# Altium project smart_garden.PrjPcb
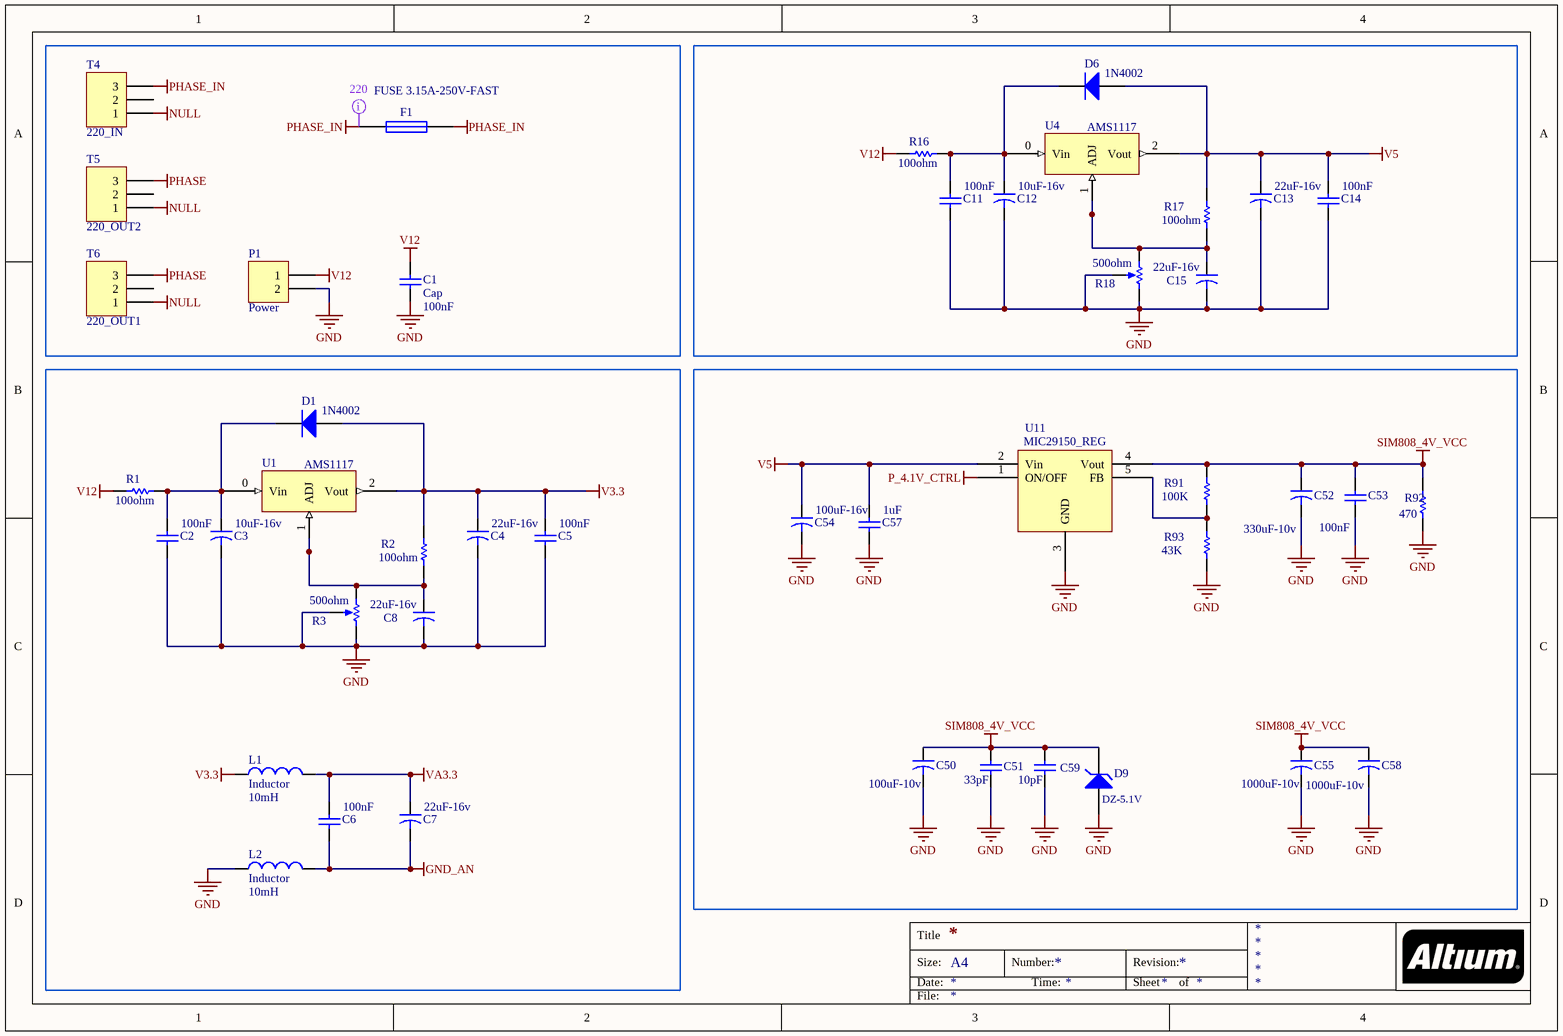
[diagram p0: smartGarden_Pow_Rev01.SchDoc]
8 sheets, 270 parts. Net scope: global (net labels, ports and power ports of the same name join across sheets).
Sheets:
  smartGarden_Pow_Rev01.SchDoc
  smartGarden_Sen_Rev01.SchDoc
  smartGarden_Mcu_Rev01.SchDoc
  smartGarden_ACT_Rev01.SchDoc
  smartGarden_COM_Rev01.SchDoc
  smartGarden_Per_Rev01.SchDoc
  smartGarden_Driver_Rev01.SchDoc
  smartGarden_COM2_Rev01.SchDoc

## Sheet smartGarden_Pow_Rev01.SchDoc
size A4

### Parts
C1  Cap  value 100nF  [0805_smd]
C2  value 100nF  [0805_smd]  (hidden comment: Cap)
C3  value 10uF-16v  [CAPR5-4X5]  (hidden comment: Cap2)
C4  value 22uF-16v  [C100uF/25V]  (hidden comment: Cap2)
C5  value 100nF  [0805_smd]  (hidden comment: Cap)
C6  value 100nF  [0805_smd]  (hidden comment: Cap)
C7  value 22uF-16v  [C100uF/25V]  (hidden comment: Cap2)
C8  value 22uF-16v  [C100uF/25V]  (hidden comment: Cap2)
C11  value 100nF  [0805_smd]  (hidden comment: Cap)
C12  value 10uF-16v  [CAPR5-4X5]  (hidden comment: Cap2)
C13  value 22uF-16v  [C100uF/25V]  (hidden comment: Cap2)
C14  value 100nF  [0805_smd]  (hidden comment: Cap)
C15  value 22uF-16v  [C100uF/25V]  (hidden comment: Cap2)
C50  value 100uF-10v  [CAPR5-4X5]  (hidden comment: Cap2)
C51  33pF  [0805_smd]
C52  value 330uF-10v  [CAPR5-4X5]  (hidden comment: Cap2)
C53  value 100nF  [0805_smd]  (hidden comment: Cap)
C54  value 100uF-16v  [C100uF/25V]  (hidden comment: Cap2)
C55  value 1000uF-10v  [CAPR5-4X5]  (hidden comment: Cap2)
C57  value 1uF  [0805_smd]  (hidden comment: Cap)
C58  value 1000uF-10v  [CAPR5-4X5]  (hidden comment: Cap2)
C59  10pF  [0805_smd]
D1  1N4002  [7227_SMD]
D6  1N4002  [7227_SMD]
D9  DZ-5.1V  [MLL34_SMD]
F1  FUSE 3.15A-250V-FAST  [FUSE1]
L1  Inductor  value 10mH  [0402-A]
L2  Inductor  value 10mH  [0402-A]
P1  Power  [PCON_L2]
R1  value 100ohm  [1206_SMD]  (hidden comment: Res1)
R2  value 100ohm  [0805_smd]  (hidden comment: Res1)
R3  value 500ohm  [Trimmer Pot]  (hidden comment: RPot)
R16  value 100ohm  [1206_SMD]  (hidden comment: Res1)
R17  value 100ohm  [0805_smd]  (hidden comment: Res1)
R18  value 500ohm  [Trimmer Pot]  (hidden comment: RPot)
R91  value 100K  [0805_smd]  (hidden comment: Res1)
R92  value 470  [1206_SMD]  (hidden comment: Res1)
R93  value 43K  [0805_smd]  (hidden comment: Res1)
T4  220_IN  [PCON_L3]
T5  220_OUT2  [PCON_L3]
T6  220_OUT1  [PCON_L3]
U1  AMS1117  [SOT223]
U4  AMS1117  [SOT223]
U11  MIC29150_REG

### Nets
GND: C1.1 C2.1 C3.2 C4.2 C5.1 C8.2 C11.1 C12.2 C13.2 C14.1 C15.2 C50.2 C51.1 C52.2 C53.1 C54.2 C55.2 C57.1 C58.2 C59.1 D9.A L2.1 P1.2 R3.2(BOT) R3.3(TAP) R18.2(BOT) R18.3(TAP) R92.1 R93.1 U11.3(GND)
GND_AN: C6.1 C7.2 L2.2
NULL: T4.1 T5.1 T6.1
P_4.1V_CTRL: U11.1(ON/OFF)
PHASE: T5.3 T6.3
PHASE_IN: F1.1 F1.2 T4.3
SIM808_4V_VCC: C50.1 C51.2 C52.1 C53.2 C55.1 C58.1 C59.2 D9.K R91.2 R92.2 U11.4(Vout)
V3.3: C4.1 C5.2 D1.1(A) L1.1 R2.2 U1.2(Vout)
V5: C13.1 C14.2 C54.1 C57.2 D6.1(A) R17.2 U4.2(Vout) U11.2(Vin)
V12: C1.2 P1.1 R1.2 R16.2
VA3.3: C6.2 C7.1 L1.2
NetC2_2: C2.2 C3.1 D1.2(K) R1.1 U1.0(Vin)
NetC8_1: C8.1 R2.1 R3.1(TOP) U1.1(ADJ)
NetC11_2: C11.2 C12.1 D6.2(K) R16.1 U4.0(Vin)
NetC15_1: C15.1 R17.1 R18.1(TOP) U4.1(ADJ)
NetR91_1: R91.1 R93.2 U11.5(FB)

Not connected (* = marked no-connect by the designer): T4 2; T5 2; T6 2

### Layout directives
net class 220: PHASE_IN

### Notes on the sheet
- Title
- Size:
- Date:
- A4
- Number:
- Time:
- Revision:
- Sheet
- of
- File:

### Library data of the parts
C1 C2 C5 C6 C11 C14 C53 C57 = Cap: Capacitor; Published: 8-Jun-2000; LatestRevisionDate: 17-Jul-2002; LatestRevisionNote: Re-released for DXP Platform.; PackageReference: RAD-0.3; Publisher: Altium Limited; PackageDescription: Radial Cap, Thru-Hole; 2 Leads; 0.3 in Pin Spacing
C3 C4 C7 C8 C12 C13 C15 C50 C52 C54 C55 C58 = Cap2: Capacitor; Published: 23-Sep-2002; PackageReference: CAPR5-4X5; Publisher: Altium Limited; PackageDescription: Capacitor; 2 Leads
C51 C59 = Cap: Capacitor; Value: 100u; Published: 8-Jun-2000; LatestRevisionDate: 17-Jul-2002; LatestRevisionNote: Re-released for DXP Platform.; PackageReference: RAD-0.3; Publisher: Altium Limited
D1 D6 = Diode 1N4002: 1 Amp General Purpose Rectifier; Published: 8-Jun-2000; LatestRevisionDate: 17-Jul-2002; LatestRevisionNote: Re-released for DXP Platform.; DatasheetVersion: 1998; PackageVersion: Aug-1999; PackageReference: DO-41; Publisher: Altium Limited; PackageDescription: Diode, Axial; Body 5.2 x 2.7 mm (LxDia. max), Lead Dia. 0.86 mm (max); Code_JEDEC: DO-204-AL; ComponentLink1Description: Manufacturer Link; ComponentLink1URL: http://www.fairchildsemi.com/; ComponentLink2Description: Datasheet; ComponentLink2URL: http://www.fairchildsemi.com/ds/1N%2F1N4001.pdf
D9 = D Zener: Zener Diode; Published: 8-Jun-2000; LatestRevisionDate: 17-Jul-2002; LatestRevisionNote: Re-released for DXP Platform.; PackageReference: DIODE-0.7; Publisher: Altium Limited
F1 = FUSE1: Fuse
L1 L2 = Inductor: Code_IEC: 1005; Published: 8-Jun-2000; LatestRevisionDate: 29-May-2009; LatestRevisionNote: IPC-7351 Footprint Added.; PackageReference: 0402-A; Publisher: Altium Limited; PackageDescription: Chip Inductor; Code_JEITA: 0402
P1 = Header 2: Header, 2-Pin; LatestRevisionDate: 17-Jul-2002; LatestRevisionNote: Re-released for DXP Platform.; Publisher: Altium Limited
R1 R2 R16 R17 R91-R93 = Res1: Resistor; Published: 8-Jun-2000; LatestRevisionDate: 17-Jul-2002; LatestRevisionNote: Re-released for DXP Platform.; PackageReference: AXIAL-0.3; Publisher: Altium Limited; PackageDescription: Axial Device, Thru-Hole; 2 Leads; 0.3 in Pin Spacing
R3 R18 = RPot: Potentiometer; Sim Note: Enter the Resistance value and the set point into parameter fields.; Set Position: 0.5; Published: 8-Jun-2000; LatestRevisionDate: 17-Jul-2002; LatestRevisionNote: Re-released for DXP Platform.; PackageReference: VR5; Publisher: Altium Limited; PackageDescription: Variable Resistor, Thru-Hole; 3 Leads
T4-T6 = Header 3: Header, 3-Pin; LatestRevisionDate: 17-Jul-2002; LatestRevisionNote: Re-released for DXP Platform.; Publisher: Altium Limited
U1 U4 = AMS1117: pin to pad: 0>3

## Sheet smartGarden_Sen_Rev01.SchDoc
size A
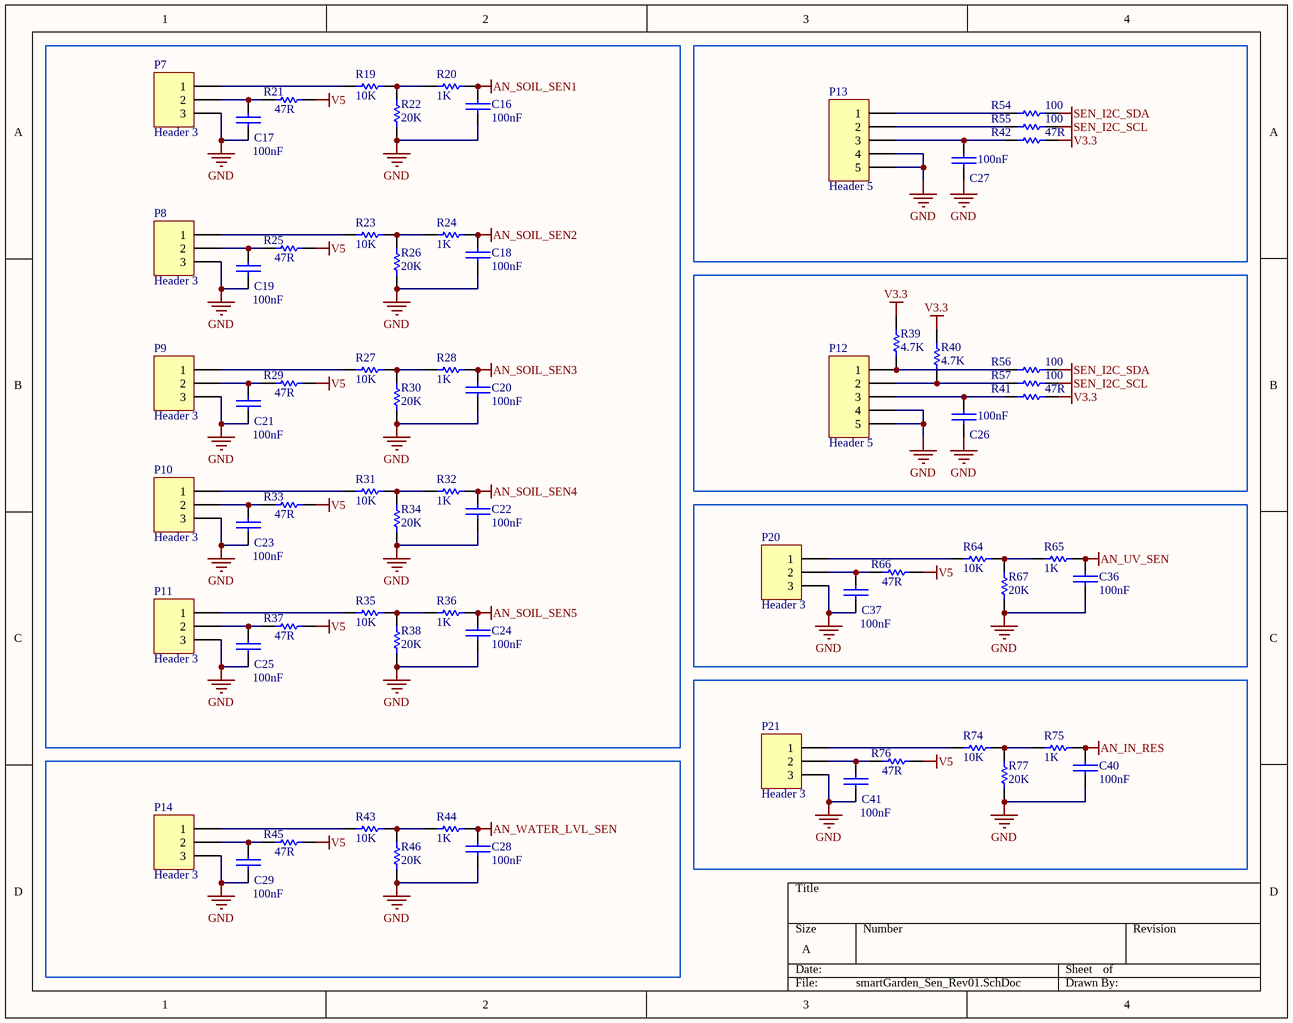
[diagram p1: smartGarden_Sen_Rev01.SchDoc]

### Parts
C16  100nF  [0805_smd]
C17  100nF  [0805_smd]
C18  100nF  [0805_smd]
C19  100nF  [0805_smd]
C20  100nF  [0805_smd]
C21  100nF  [0805_smd]
C22  100nF  [0805_smd]
C23  100nF  [0805_smd]
C24  100nF  [0805_smd]
C25  100nF  [0805_smd]
C26  100nF  [0805_smd]
C27  100nF  [0805_smd]
C28  100nF  [0805_smd]
C29  100nF  [0805_smd]
C36  100nF  [0805_smd]
C37  100nF  [0805_smd]
C40  100nF  [0805_smd]
C41  100nF  [0805_smd]
P7  Header 3  [HDR1X3]
P8  Header 3  [HDR1X3]
P9  Header 3  [HDR1X3]
P10  Header 3  [HDR1X3]
P11  Header 3  [HDR1X3]
P12  Header 5  [HDR1X5]
P13  Header 5  [HDR1X5]
P14  Header 3  [HDR1X3]
P20  Header 3  [HDR1X3]
P21  Header 3  [HDR1X3]
R19  10K  [0805_smd]
R20  1K  [0805_smd]
R21  47R  [0805_smd]
R22  20K  [0805_smd]
R23  10K  [0805_smd]
R24  1K  [0805_smd]
R25  47R  [0805_smd]
R26  20K  [0805_smd]
R27  10K  [0805_smd]
R28  1K  [0805_smd]
R29  47R  [0805_smd]
R30  20K  [0805_smd]
R31  10K  [0805_smd]
R32  1K  [0805_smd]
R33  47R  [0805_smd]
R34  20K  [0805_smd]
R35  10K  [0805_smd]
R36  1K  [0805_smd]
R37  47R  [0805_smd]
R38  20K  [0805_smd]
R39  4.7K  [0805_smd]
R40  4.7K  [0805_smd]
R41  47R  [0805_smd]
R42  47R  [0805_smd]
R43  10K  [0805_smd]
R44  1K  [0805_smd]
R45  47R  [0805_smd]
R46  20K  [0805_smd]
R54  100  [0805_smd]
R55  100  [0805_smd]
R56  100  [0805_smd]
R57  100  [0805_smd]
R64  10K  [0805_smd]
R65  1K  [0805_smd]
R66  47R  [0805_smd]
R67  20K  [0805_smd]
R74  10K  [0805_smd]
R75  1K  [0805_smd]
R76  47R  [0805_smd]
R77  20K  [0805_smd]

### Nets
AN_IN_RES: C40.2 R75.1
AN_SOIL_SEN1: C16.2 R20.1
AN_SOIL_SEN2: C18.2 R24.1
AN_SOIL_SEN3: C20.2 R28.1
AN_SOIL_SEN4: C22.2 R32.1
AN_SOIL_SEN5: C24.2 R36.1
AN_UV_SEN: C36.2 R65.1
AN_WATER_LVL_SEN: C28.2 R44.1
GND: C16.1 C17.1 C18.1 C19.1 C20.1 C21.1 C22.1 C23.1 C24.1 C25.1 C26.1 C27.1 C28.1 C29.1 C36.1 C37.1 C40.1 C41.1 P7.3 P8.3 P9.3 P10.3 P11.3 P12.4 P12.5 P13.4 P13.5 P14.3 P20.3 P21.3 R22.2 R26.2 R30.2 R34.2 R38.2 R46.2 R67.2 R77.2
SEN_I2C_SCL: R55.1 R57.1
SEN_I2C_SDA: R54.1 R56.1
V3.3: R39.1 R40.1 R41.1 R42.1
V5: R21.1 R25.1 R29.1 R33.1 R37.1 R45.1 R66.1 R76.1
NetC17_2: C17.2 P7.2 R21.2
NetC19_2: C19.2 P8.2 R25.2
NetC21_2: C21.2 P9.2 R29.2
NetC23_2: C23.2 P10.2 R33.2
NetC25_2: C25.2 P11.2 R37.2
NetC26_2: C26.2 P12.3 R41.2
NetC27_2: C27.2 P13.3 R42.2
NetC29_2: C29.2 P14.2 R45.2
NetC37_2: C37.2 P20.2 R66.2
NetC41_2: C41.2 P21.2 R76.2
NetP7_1: P7.1 R19.2
NetP8_1: P8.1 R23.2
NetP9_1: P9.1 R27.2
NetP10_1: P10.1 R31.2
NetP11_1: P11.1 R35.2
NetP12_1: P12.1 R39.2 R56.2
NetP12_2: P12.2 R40.2 R57.2
NetP13_1: P13.1 R54.2
NetP13_2: P13.2 R55.2
NetP14_1: P14.1 R43.2
NetP20_1: P20.1 R64.2
NetP21_1: P21.1 R74.2
NetR19_1: R19.1 R20.2 R22.1
NetR23_1: R23.1 R24.2 R26.1
NetR27_1: R27.1 R28.2 R30.1
NetR31_1: R31.1 R32.2 R34.1
NetR35_1: R35.1 R36.2 R38.1
NetR43_1: R43.1 R44.2 R46.1
NetR64_1: R64.1 R65.2 R67.1
NetR74_1: R74.1 R75.2 R77.1

### Library data of the parts
C16-C29 C36 C37 C40 C41 = CAP: Capacitor
P7-P11 P14 P20 P21 = Header 3: Header, 3-Pin; LatestRevisionDate: 17-Jul-2002; LatestRevisionNote: Re-released for DXP Platform.; Publisher: Altium Limited
P12 P13 = Header 5: Header, 5-Pin; LatestRevisionDate: 17-Jul-2002; LatestRevisionNote: Re-released for DXP Platform.; Publisher: Altium Limited
R19-R46 R54-R57 R64-R67 R74-R77 = Res1: Resistor; Published: 8-Jun-2000; LatestRevisionDate: 17-Jul-2002; LatestRevisionNote: Re-released for DXP Platform.; PackageReference: AXIAL-0.3; Publisher: Altium Limited

## Sheet smartGarden_Mcu_Rev01.SchDoc
size A
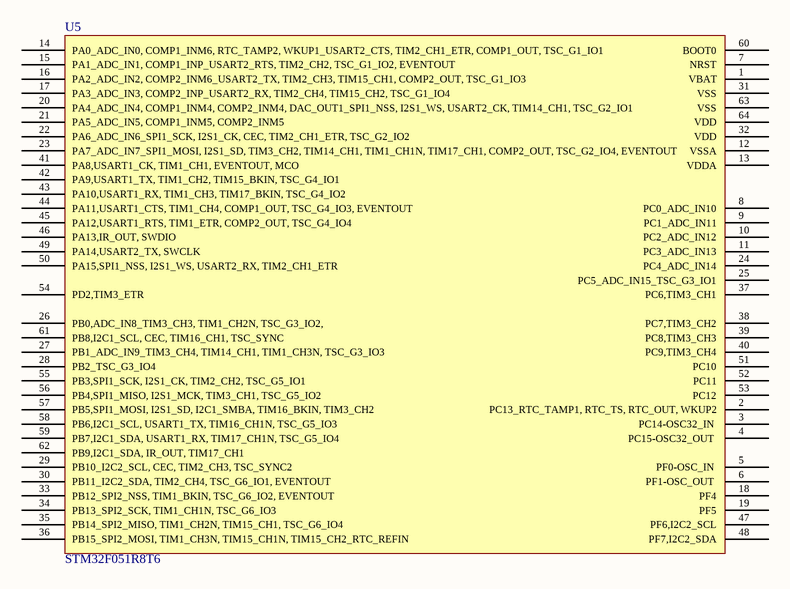
[diagram p2: smartGarden_Mcu_Rev01.SchDoc]

### Parts
U5  STM32F051R8T6  [LQFP64]

### Nets

Not connected (* = marked no-connect by the designer): U5 1(VBAT) 2(PC13_RTC_TAMP1,_RTC_TS,_RTC_OUT,_WKUP2) 3(PC14-OSC32_IN_) 4(PC15-OSC32_OUT_) 5(PF0-OSC_IN_) 6(PF1-OSC_OUT_) 7(NRST) 8(PC0_ADC_IN10) 9(PC1_ADC_IN11) 10(PC2_ADC_IN12) 11(PC3_ADC_IN13) 12(VSSA) 13(VDDA) 14(PA0_ADC_IN0,_COMP1_INM6,_RTC_TAMP2,_WKUP1_USART2_CTS,_TIM2_CH1_ETR,_COMP1_OUT,_TSC_G1_IO1) 15(PA1_ADC_IN1,_COMP1_INP_USART2_RTS,_TIM2_CH2,_TSC_G1_IO2,_EVENTOUT) 16(PA2_ADC_IN2,_COMP2_INM6_USART2_TX,_TIM2_CH3,_TIM15_CH1,_COMP2_OUT,_TSC_G1_IO3) 17(PA3_ADC_IN3,_COMP2_INP_USART2_RX,_TIM2_CH4,_TIM15_CH2,_TSC_G1_IO4) 18(PF4) 19(PF5) 20(PA4_ADC_IN4,_COMP1_INM4,_COMP2_INM4,_DAC_OUT1_SPI1_NSS,_I2S1_WS,_USART2_CK,_TIM14_CH1,_TSC_G2_IO1) 21(PA5_ADC_IN5,_COMP1_INM5,_COMP2_INM5) 22(PA6_ADC_IN6_SPI1_SCK,_I2S1_CK,_CEC,_TIM2_CH1_ETR,_TSC_G2_IO2) 23(PA7_ADC_IN7_SPI1_MOSI,_I2S1_SD,_TIM3_CH2,_TIM14_CH1,_TIM1_CH1N,_TIM17_CH1,_COMP2_OUT,_TSC_G2_IO4,_EVENTOUT) 24(PC4_ADC_IN14) 25(PC5_ADC_IN15_TSC_G3_IO1) 26(PB0,ADC_IN8_TIM3_CH3,_TIM1_CH2N,_TSC_G3_IO2,_) 27(PB1_ADC_IN9_TIM3_CH4,_TIM14_CH1,_TIM1_CH3N,_TSC_G3_IO3) 28(PB2_TSC_G3_IO4) 29(PB10_I2C2_SCL,_CEC,_TIM2_CH3,_TSC_SYNC2) 30(PB11_I2C2_SDA,_TIM2_CH4,_TSC_G6_IO1,_EVENTOUT) 31(VSS) 32(VDD) 33(PB12_SPI2_NSS,_TIM1_BKIN,_TSC_G6_IO2,_EVENTOUT) 34(PB13_SPI2_SCK,_TIM1_CH1N,_TSC_G6_IO3) 35(PB14_SPI2_MISO,_TIM1_CH2N,_TIM15_CH1,_TSC_G6_IO4) 36(PB15_SPI2_MOSI,_TIM1_CH3N,_TIM15_CH1N,_TIM15_CH2_RTC_REFIN) 37(PC6,TIM3_CH1) 38(PC7,TIM3_CH2) 39(PC8,TIM3_CH3) 40(PC9,TIM3_CH4) 41(PA8,USART1_CK,_TIM1_CH1,_EVENTOUT,_MCO) 42(PA9,USART1_TX,_TIM1_CH2,_TIM15_BKIN,_TSC_G4_IO1) 43(PA10,USART1_RX,_TIM1_CH3,_TIM17_BKIN,_TSC_G4_IO2) 44(PA11,USART1_CTS,_TIM1_CH4,_COMP1_OUT,_TSC_G4_IO3,_EVENTOUT) 45(PA12,USART1_RTS,_TIM1_ETR,_COMP2_OUT,_TSC_G4_IO4) 46(PA13,IR_OUT,_SWDIO) 47(PF6,I2C2_SCL) 48(PF7,I2C2_SDA) 49(PA14,USART2_TX,_SWCLK) 50(PA15,SPI1_NSS,_I2S1_WS,_USART2_RX,_TIM2_CH1_ETR) 51(PC10) 52(PC11) 53(PC12) 54(PD2,TIM3_ETR) 55(PB3,SPI1_SCK,_I2S1_CK,_TIM2_CH2,_TSC_G5_IO1) 56(PB4,SPI1_MISO,_I2S1_MCK,_TIM3_CH1,_TSC_G5_IO2) 57(PB5,SPI1_MOSI,_I2S1_SD,_I2C1_SMBA,_TIM16_BKIN,_TIM3_CH2) 58(PB6,I2C1_SCL,_USART1_TX,_TIM16_CH1N,_TSC_G5_IO3) 59(PB7,I2C1_SDA,_USART1_RX,_TIM17_CH1N,_TSC_G5_IO4) 60(BOOT0) 61(PB8,I2C1_SCL,_CEC,_TIM16_CH1,_TSC_SYNC) 62(PB9,I2C1_SDA,_IR_OUT,_TIM17_CH1) 63(VSS) 64(VDD)

## Sheet smartGarden_ACT_Rev01.SchDoc
size A
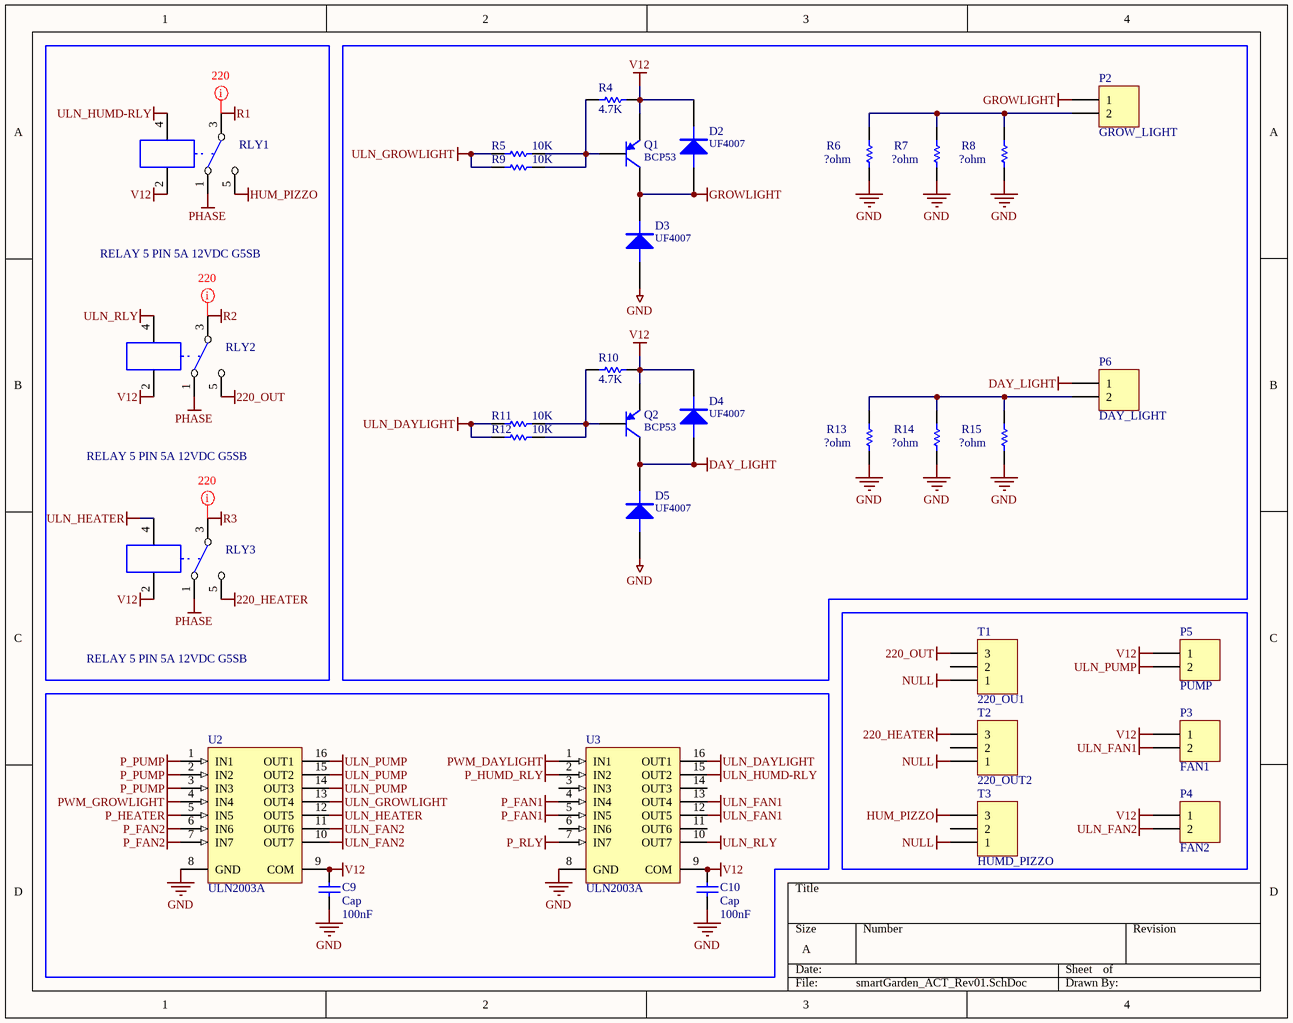
[diagram p3: smartGarden_ACT_Rev01.SchDoc]

### Parts
C9  Cap  value 100nF  [0805_smd]
C10  Cap  value 100nF  [0805_smd]
D2  UF4007  [7227_SMD]
D3  UF4007  [7227_SMD]
D4  UF4007  [7227_SMD]
D5  UF4007  [7227_SMD]
P2  GROW_LIGHT  [PCON_L2]
P3  FAN1  [CON2_XH]
P4  FAN2  [CON2_XH]
P5  PUMP  [CON2_XH]
P6  DAY_LIGHT  [PCON_L2]
Q1  BCP53  [SOT223]
Q2  BCP53  [SOT223]
R4  4.7K  [0805_smd]
R5  10K  [1206_SMD]
R6  value ?ohm  [0805_smd]  (hidden comment: Res1)
R7  value ?ohm  [0805_smd]  (hidden comment: Res1)
R8  value ?ohm  [0805_smd]  (hidden comment: Res1)
R9  10K  [1206_SMD]
R10  4.7K  [0805_smd]
R11  10K  [1206_SMD]
R12  10K  [1206_SMD]
R13  value ?ohm  [0805_smd]  (hidden comment: Res1)
R14  value ?ohm  [0805_smd]  (hidden comment: Res1)
R15  value ?ohm  [0805_smd]  (hidden comment: Res1)
RLY1  RELAY 5 PIN 5A 12VDC G5SB  [RLY_G5S]
RLY2  RELAY 5 PIN 5A 12VDC G5SB  [RLY_G5S]
RLY3  RELAY 5 PIN 5A 12VDC G5SB  [RLY_G5S]
T1  220_OU1  [PCON_L3]
T2  220_OUT2  [PCON_L3]
T3  HUMD_PIZZO  [PCON_L3]
U2  ULN2003A  [SO-16_smd]
U3  ULN2003A  [SO-16_smd]

### Nets
220_HEATER: RLY3.5(NO) T2.3
220_OUT: RLY2.5(NO) T1.3
DAY_LIGHT: D4.A D5.K P6.1 Q2.2(C)
GND: C9.1 C10.1 D3.A D5.A R6.1 R7.1 R8.1 R13.1 R14.1 R15.1 U2.8(GND) U3.8(GND)
GROWLIGHT: D2.A D3.K P2.1 Q1.2(C)
HUM_PIZZO: RLY1.5(NO) T3.3
NULL: T1.1 T2.1 T3.1
P_FAN1: U3.4(IN4) U3.5(IN5)
P_FAN2: U2.6(IN6) U2.7(IN7)
P_HEATER: U2.5(IN5)
P_HUMD_RLY: U3.2(IN2)
P_PUMP: U2.1(IN1) U2.2(IN2) U2.3(IN3)
P_RLY: U3.7(IN7)
PHASE: RLY1.1(NC) RLY2.1(NC) RLY3.1(NC)
PWM_DAYLIGHT: U3.1(IN1)
PWM_GROWLIGHT: U2.4(IN4)
R1: RLY1.3(COM)
R2: RLY2.3(COM)
R3: RLY3.3(COM)
ULN_DAYLIGHT: R11.2 R12.2 U3.16(OUT1)
ULN_FAN1: P3.2 U3.12(OUT5) U3.13(OUT4)
ULN_FAN2: P4.2 U2.10(OUT7) U2.11(OUT6)
ULN_GROWLIGHT: R5.2 R9.2 U2.13(OUT4)
ULN_HEATER: RLY3.4(B) U2.12(OUT5)
ULN_HUMD-RLY: RLY1.4(B) U3.15(OUT2)
ULN_PUMP: P5.2 U2.14(OUT3) U2.15(OUT2) U2.16(OUT1)
ULN_RLY: RLY2.4(B) U3.10(OUT7)
V12: C9.2 C10.2 D2.K D4.K P3.1 P4.1 P5.1 Q1.3(E) Q2.3(E) R4.1 R10.1 RLY1.2(A) RLY2.2(A) RLY3.2(A) U2.9(COM) U3.9(COM)
NetP2_2: P2.2 R6.2 R7.2 R8.2
NetP6_2: P6.2 R13.2 R14.2 R15.2
NetQ1_1: Q1.1(B) R4.2 R5.1 R9.1
NetQ2_1: Q2.1(B) R10.2 R11.1 R12.1

Not connected (* = marked no-connect by the designer): T1 2; T2 2; T3 2; U3 3(IN3) 6(IN6) 11(OUT6) 14(OUT3)

### Layout directives
net class 220: R1, R2, R3

### Library data of the parts
C9 C10 = Cap: Capacitor; Published: 8-Jun-2000; LatestRevisionDate: 17-Jul-2002; LatestRevisionNote: Re-released for DXP Platform.; PackageReference: RAD-0.3; Publisher: Altium Limited; PackageDescription: Radial Cap, Thru-Hole; 2 Leads; 0.3 in Pin Spacing
D2-D5 = DIODE
P2-P6 = Header 2: Header, 2-Pin; LatestRevisionDate: 17-Jul-2002; LatestRevisionNote: Re-released for DXP Platform.; Publisher: Altium Limited
Q1 Q2 = 2N3906
R4 R5 R9-R12 = Res: Resistor; LatestRevisionNote: Re-released for DXP Platform.; PackageDescription: Axial Device, Thru-Hole; 2 Leads; 0.3 in Pin Spacing; PackageReference: AXIAL-0.3; Published: 8-Jun-2000; Publisher: Altium Limited; LatestRevisionDate: 17-Jul-2002
R6-R8 R13-R15 = Res1: Resistor; Published: 8-Jun-2000; LatestRevisionDate: 17-Jul-2002; LatestRevisionNote: Re-released for DXP Platform.; PackageReference: AXIAL-0.3; Publisher: Altium Limited; PackageDescription: Axial Device, Thru-Hole; 2 Leads; 0.3 in Pin Spacing
RLY1-RLY3 = RELAY-SPDT
T1-T3 = Header 3: Header, 3-Pin; LatestRevisionDate: 17-Jul-2002; LatestRevisionNote: Re-released for DXP Platform.; Publisher: Altium Limited
U2 U3 = ULN2004A: High-Voltage, High-Current Darlington Array; Published: 13-Oct-2000; LatestRevisionDate: 06-Jun-2005; LatestRevisionNote: Stylized 3D Model Added.; DatasheetVersion: 1998; PackageVersion: 1998; PackageReference: A16; Publisher: Altium Limited; PackageDescription: DIP; 16 Leads; Row Spacing 7.62 mm; Pitch 2.54 mm; Code_JEDEC: MS-001-BB; ComponentLink1Description: Manufacturer Link; ComponentLink1URL: http://www.allegromicro.com/

## Sheet smartGarden_COM_Rev01.SchDoc
size A
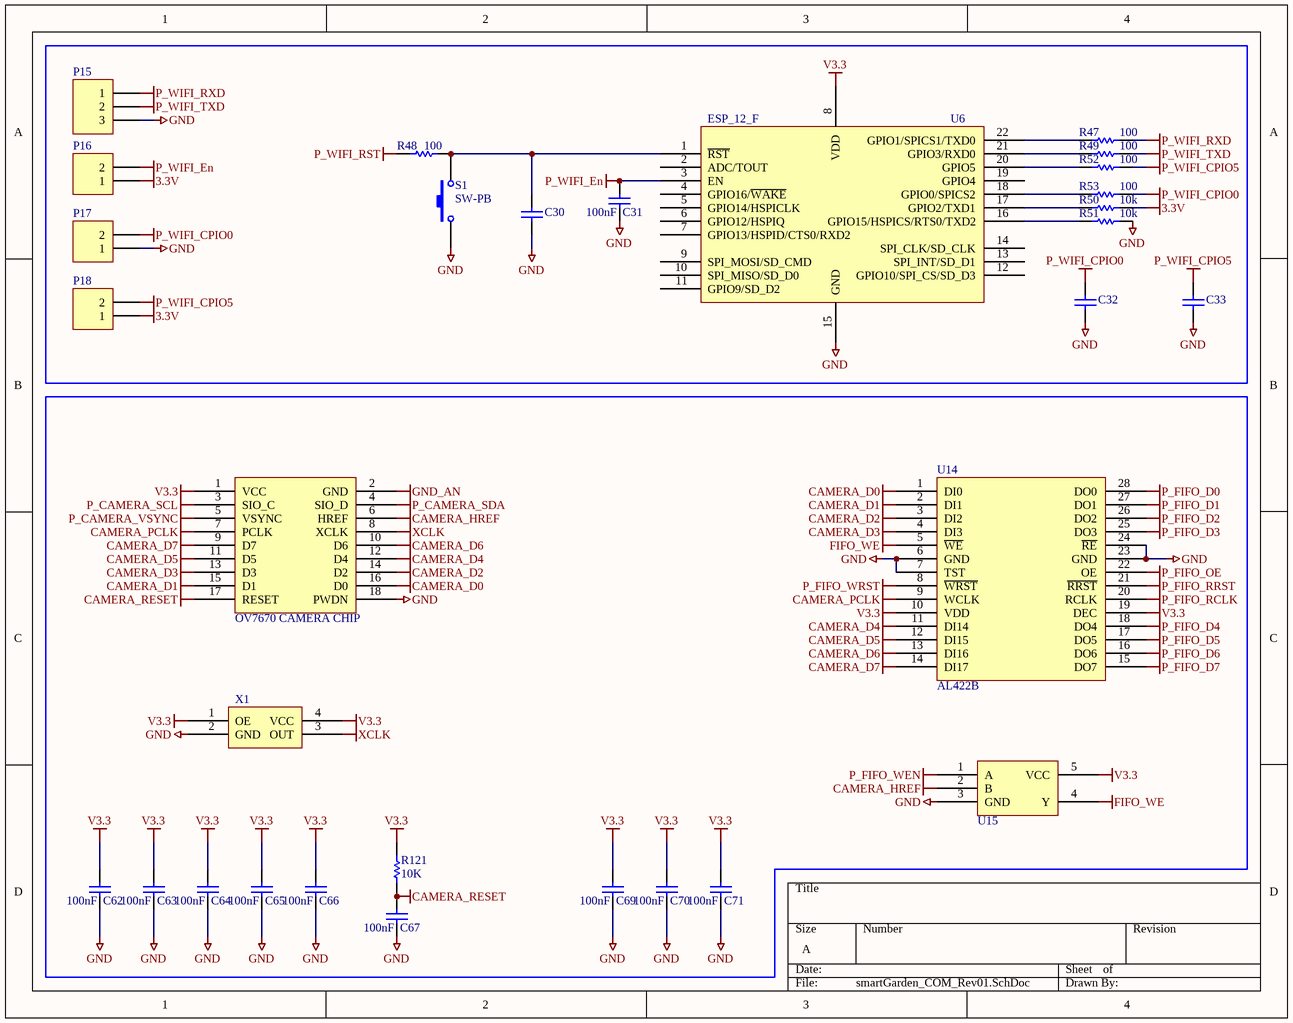
[diagram p4: smartGarden_COM_Rev01.SchDoc]

### Parts
C30  100nF_SKIP  [0805_smd]  (value not drawn)
C31  100nF  [0805_SMD]
C32  100n_skip  [0805_SMD]  (value not drawn)
C33  100n_skip  [0805_SMD]  (value not drawn)
C62  100nF  [0805_SMD]
C63  100nF  [0805_SMD]
C64  100nF  [0805_SMD]
C65  100nF  [0805_SMD]
C66  100nF  [0805_SMD]
C67  100nF  [0805_SMD]
C69  100nF  [0805_SMD]
C70  100nF  [0805_SMD]
C71  100nF  [0805_SMD]
P15  CON 1*40 PIN HEADER 5H MALE 2.54  [CON3_XH]  (value not drawn)
P16  Header 2  [HDR1X2]  (value not drawn)
P17  Header 2  [HDR1X2]  (value not drawn)
P18  Header 2  [HDR1X2]  (value not drawn)
R47  100  [0805_smd]
R48  100  [0805_smd]
R49  100  [0805_smd]
R50  10k  [0805_smd]
R51  10k  [0805_smd]
R52  100  [0805_smd]
R53  100  [0805_smd]
R121  10K  [0805_smd]
S1  SW-PB  [SW_4.5*4.5]
U6  ESP_12_F  [ESP_12_E]
U13  OV7670 CAMERA CHIP
U14  AL422B
U15  NAND  (value not drawn)
X1  4PIN OSCILLATOR  (value not drawn)

### Nets
3.3V: P16.1 P18.1 R50.1
CAMERA_D0: U13.16(D0) U14.1(DI0)
CAMERA_D1: U13.15(D1) U14.2(DI1)
CAMERA_D2: U13.14(D2) U14.3(DI2)
CAMERA_D3: U13.13(D3) U14.4(DI3)
CAMERA_D4: U13.12(D4) U14.11(DI14)
CAMERA_D5: U13.11(D5) U14.12(DI15)
CAMERA_D6: U13.10(D6) U14.13(DI16)
CAMERA_D7: U13.9(D7) U14.14(DI17)
CAMERA_HREF: U13.6(HREF) U15.2(B)
CAMERA_PCLK: U13.7(PCLK) U14.9(WCLK)
CAMERA_RESET: C67.2 R121.2 U13.17(RESET)
FIFO_WE: U14.5(~{WE}) U15.4(Y)
GND: C30.1 C31.1 C32.1 C33.1 C62.1 C63.1 C64.1 C65.1 C66.1 C67.1 C69.1 C70.1 C71.1 P15.3 P17.1 R51.1 S1.1 U6.15(GND) U13.18(PWDN) U14.6(GND) U14.7(TST) U14.23(GND) U14.24(~{RE}) U15.3(GND) X1.2(GND)
GND_AN: U13.2(GND)
P_CAMERA_SCL: U13.3(SIO_C)
P_CAMERA_SDA: U13.4(SIO_D)
P_CAMERA_VSYNC: U13.5(VSYNC)
P_FIFO_D0: U14.28(DO0)
P_FIFO_D1: U14.27(DO1)
P_FIFO_D2: U14.26(DO2)
P_FIFO_D3: U14.25(DO3)
P_FIFO_D4: U14.18(DO4)
P_FIFO_D5: U14.17(DO5)
P_FIFO_D6: U14.16(DO6)
P_FIFO_D7: U14.15(DO7)
P_FIFO_OE: U14.22(OE)
P_FIFO_RCLK: U14.20(RCLK)
P_FIFO_RRST: U14.21(~{RRST})
P_FIFO_WEN: U15.1(A)
P_FIFO_WRST: U14.8(~{WRST})
P_WIFI_CPIO0: C32.2 P17.2 R53.1
P_WIFI_CPIO5: C33.2 P18.2 R52.1
P_WIFI_En: C31.2 P16.2 U6.3(EN)
P_WIFI_RST: R48.2
P_WIFI_RXD: P15.1 R47.1
P_WIFI_TXD: P15.2 R49.1
V3.3: C62.2 C63.2 C64.2 C65.2 C66.2 C69.2 C70.2 C71.2 R121.1 U6.8(VDD) U13.1(VCC) U14.10(VDD) U14.19(DEC) U15.5(VCC) X1.1(OE) X1.4(VCC)
XCLK: U13.8(XCLK) X1.3(OUT)
NetC30_2: C30.2 R48.1 S1.2 U6.1(~{RST})
NetR47_2: R47.2 U6.22(GPIO1/SPICS1/TXD0)
NetR49_2: R49.2 U6.21(GPIO3/RXD0)
NetR50_2: R50.2 U6.17(GPIO2/TXD1)
NetR51_2: R51.2 U6.16(GPIO15/HSPICS/RTS0/TXD2)
NetR52_2: R52.2 U6.20(GPIO5)
NetR53_2: R53.2 U6.18(GPIO0/SPICS2)

Not connected (* = marked no-connect by the designer): U6 2(ADC/TOUT) 4(GPIO16/~{WAKE}) 5(GPIO14/HSPICLK) 6(GPIO12/HSPIQ) 7(GPIO13/HSPID/CTS0/RXD2) 9(SPI_MOSI/SD_CMD) 10(SPI_MISO/SD_D0) 11(GPIO9/SD_D2) 12(GPIO10/SPI_CS/SD_D3) 13(SPI_INT/SD_D1) 14(SPI_CLK/SD_CLK) 19(GPIO4)

### Library data of the parts
C30 C32 C33 = Cap Semi: Capacitor (Semiconductor SIM Model); Value: 100nF; Published: 8-Jun-2000; LatestRevisionDate: 17-Jul-2002; LatestRevisionNote: Re-released for DXP Platform.; PackageReference: C1206; Publisher: Altium Limited
C31 C62-C67 C69-C71 = Cap Semi: Capacitor (Semiconductor SIM Model); Published: 8-Jun-2000; LatestRevisionDate: 17-Jul-2002; LatestRevisionNote: Re-released for DXP Platform.; PackageReference: C1206; Publisher: Altium Limited; Value: 100nF
P15 = Header 3: Header, 3-Pin; LatestRevisionDate: 17-Jul-2002; LatestRevisionNote: Re-released for DXP Platform.; Publisher: Altium Limited
P16-P18 = Header 2: Header, 2-Pin; LatestRevisionDate: 17-Jul-2002; LatestRevisionNote: Re-released for DXP Platform.; Publisher: Altium Limited
R47-R53 R121 = Res Semi: Semiconductor Resistor; Value: 1k; Published: 8-Jun-2000; LatestRevisionDate: 17-Jul-2002; LatestRevisionNote: Re-released for DXP Platform.; PackageReference: AXIAL-0.5; Publisher: Altium Limited
S1 = SW-PB: Switch; Published: 24-Mar-1999; LatestRevisionDate: 17-Jul-2002; LatestRevisionNote: Re-released for DXP Platform.; PackageReference: SPST-2; Publisher: Altium Limited
U6 = ESP_12_E: ESP-12 Wi-Fi Module by AI-Thinker; IC: ESP8266-EX; Vendor: Ai-thinker
U15 = SN74LVC1G00

## Sheet smartGarden_Per_Rev01.SchDoc
size A
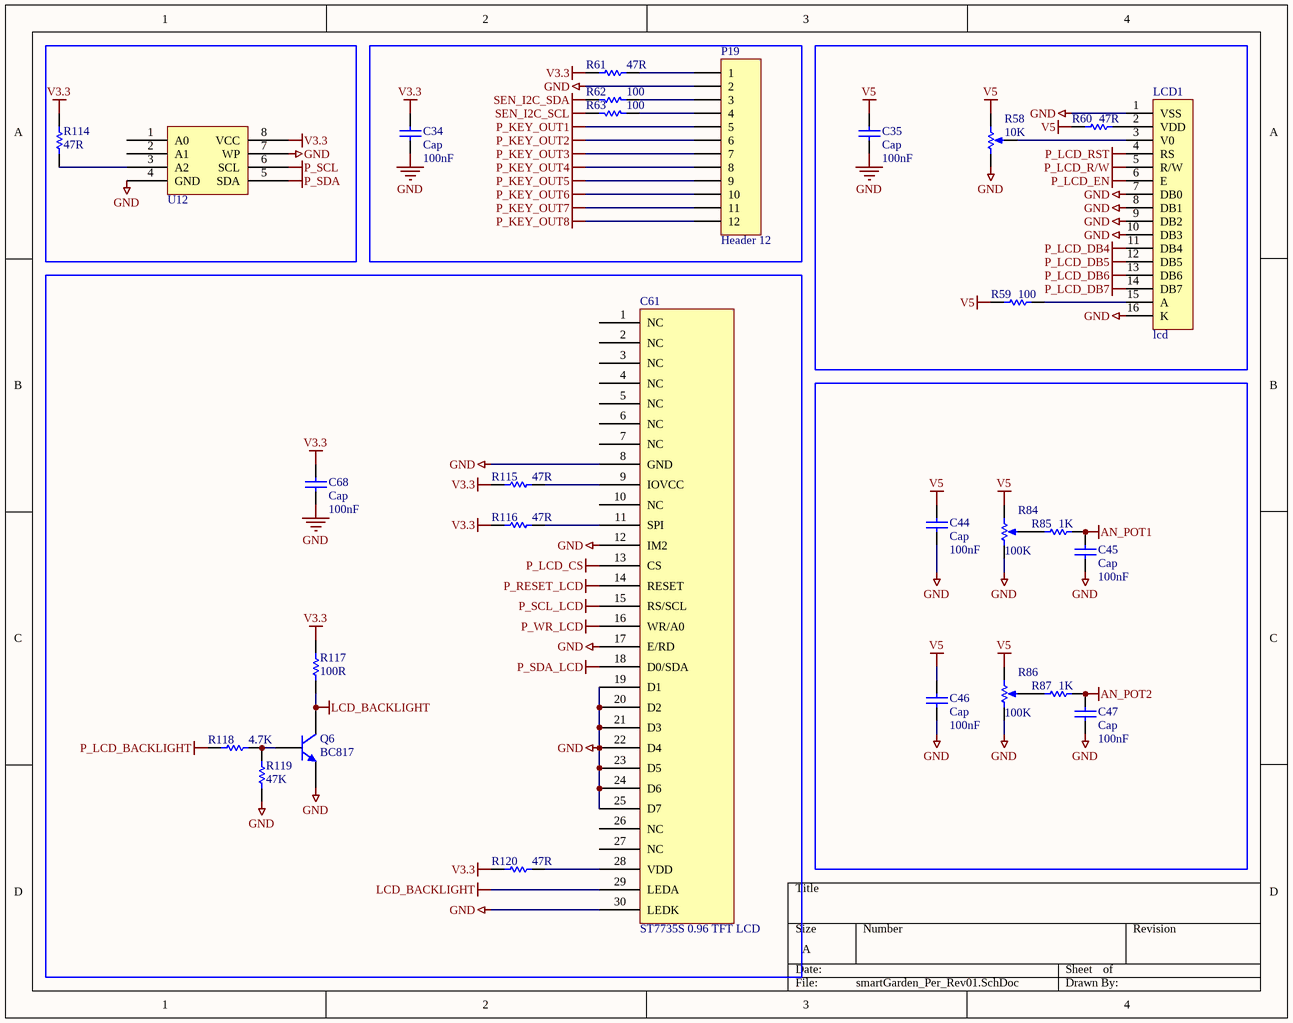
[diagram p5: smartGarden_Per_Rev01.SchDoc]

### Parts
C34  Cap  value 100nF  [0805_smd]
C35  Cap  value 100nF  [0805_smd]
C44  Cap  value 100nF  [0805_smd]
C45  Cap  value 100nF  [0805_smd]
C46  Cap  value 100nF  [0805_smd]
C47  Cap  value 100nF  [0805_smd]
C61  ST7735S 0.96 TFT LCD
C68  Cap  value 100nF  [0805_smd]
LCD1  lcd  [LCD2*16]
P19  Header 12  [CON12_XH]
Q6  BC817  [TO-226-AA]
R58  value 10K  [Trimmer Pot]  (hidden comment: RPot)
R59  100  [0805_smd]
R60  47R  [0805_smd]
R61  47R  [0805_smd]
R62  100  [0805_smd]
R63  100  [0805_smd]
R84  value 100K  [POT_V15]  (hidden comment: RPot)
R85  1K  [0805_smd]
R86  value 100K  [POT_V15]  (hidden comment: RPot)
R87  1K  [0805_smd]
R114  47R  [0805_smd]
R115  47R  [0805_smd]
R116  47R  [0805_smd]
R117  100R  [0805_smd]
R118  4.7K  [0805_smd]
R119  47K  [0805_smd]
R120  47R  [0805_smd]
U12  AT24C08  [SOIC8]  (value not drawn)

### Nets
AN_POT1: C45.2 R85.1
AN_POT2: C47.2 R87.1
GND: C34.1 C35.1 C44.1 C45.1 C46.1 C47.1 C61.8(GND) C61.12(IM2) C61.17(E/RD) C61.19(D1) C61.20(D2) C61.21(D3) C61.22(D4) C61.23(D5) C61.24(D6) C61.25(D7) C61.30(LEDK) C68.1 LCD1.1(VSS) LCD1.7(DB0) LCD1.8(DB1) LCD1.9(DB2) LCD1.10(DB3) LCD1.16(K) P19.2 Q6.3(E) R58.1(TOP) R84.1(TOP) R86.1(TOP) R119.2 U12.4(GND) U12.7(WP)
LCD_BACKLIGHT: C61.29(LEDA) Q6.1(C) R117.1
P_KEY_OUT1: P19.5
P_KEY_OUT2: P19.6
P_KEY_OUT3: P19.7
P_KEY_OUT4: P19.8
P_KEY_OUT5: P19.9
P_KEY_OUT6: P19.10
P_KEY_OUT7: P19.11
P_KEY_OUT8: P19.12
P_LCD_BACKLIGHT: R118.2
P_LCD_CS: C61.13(CS)
P_LCD_DB4: LCD1.11(DB4)
P_LCD_DB5: LCD1.12(DB5)
P_LCD_DB6: LCD1.13(DB6)
P_LCD_DB7: LCD1.14(DB7)
P_LCD_EN: LCD1.6(E)
P_LCD_R/W: LCD1.5(R/W)
P_LCD_RST: LCD1.4(RS)
P_RESET_LCD: C61.14(RESET)
P_SCL: U12.6(SCL)
P_SCL_LCD: C61.15(RS/SCL)
P_SDA: U12.5(SDA)
P_SDA_LCD: C61.18(D0/SDA)
P_WR_LCD: C61.16(WR/A0)
SEN_I2C_SCL: R63.1
SEN_I2C_SDA: R62.1
V3.3: C34.2 C68.2 R61.2 R114.1 R115.2 R116.2 R117.2 R120.2 U12.8(VCC)
V5: C35.2 C44.2 C46.2 R58.2(BOT) R59.2 R60.2 R84.2(BOT) R86.2(BOT)
NetC61_9: C61.9(IOVCC) R115.1
NetC61_11: C61.11(SPI) R116.1
NetC61_28: C61.28(VDD) R120.1
NetLCD1_2: LCD1.2(VDD) R60.1
NetLCD1_3: LCD1.3(V0) R58.3(TAP)
NetLCD1_15: LCD1.15(A) R59.1
NetP19_1: P19.1 R61.1
NetP19_3: P19.3 R62.2
NetP19_4: P19.4 R63.2
NetQ6_2: Q6.2(B) R118.1 R119.1
NetR84_3: R84.3(TAP) R85.2
NetR86_3: R86.3(TAP) R87.2
NetR114_2: R114.2 U12.3(A2)

Not connected (* = marked no-connect by the designer): C61 1(NC) 2(NC) 3(NC) 4(NC) 5(NC) 6(NC) 7(NC) 10(NC) 26(NC) 27(NC); U12 1(A0) 2(A1)

### Library data of the parts
C34 C35 C44-C47 C68 = Cap: Capacitor; Published: 8-Jun-2000; LatestRevisionDate: 17-Jul-2002; LatestRevisionNote: Re-released for DXP Platform.; PackageReference: RAD-0.3; Publisher: Altium Limited; PackageDescription: Radial Cap, Thru-Hole; 2 Leads; 0.3 in Pin Spacing
LCD1 = LCD16
P19 = Header 12: Header, 12-Pin; LatestRevisionDate: 17-Jul-2002; LatestRevisionNote: Re-released for DXP Platform.; Publisher: Altium Limited
Q6 = NPN: NPN Bipolar Transistor; Published: 8-Jun-2000; LatestRevisionDate: 17-Jul-2002; LatestRevisionNote: Re-released for DXP Platform.; PackageReference: TO-226-AA; Publisher: Altium Limited; PackageDescription: TO, Flat Index; 3 In-Line, Axial Leads; Body Dia. 4.8mm; Leads 0.55 x 0.51 mm (max); Code_JEDEC: TO-226-AA
R58 R84 R86 = RPot: as R3 on sheet smartGarden_Pow_Rev01; Published: 8-Jun-2000; LatestRevisionDate: 17-Jul-2002; LatestRevisionNote: Re-released for DXP Platform.; PackageReference: VR5; Publisher: Altium Limited; PackageDescription: Variable Resistor, Thru-Hole; 3 Leads
R59-R61 R114-R120 = Res Semi: Semiconductor Resistor; Value: 1k; Published: 8-Jun-2000; LatestRevisionDate: 17-Jul-2002; LatestRevisionNote: Re-released for DXP Platform.; PackageReference: AXIAL-0.5; Publisher: Altium Limited
R62 R63 = Res1: Resistor; Published: 8-Jun-2000; LatestRevisionDate: 17-Jul-2002; LatestRevisionNote: Re-released for DXP Platform.; PackageReference: AXIAL-0.3; Publisher: Altium Limited
R85 R87 = Res Semi: Semiconductor Resistor; Published: 8-Jun-2000; LatestRevisionDate: 17-Jul-2002; LatestRevisionNote: Re-released for DXP Platform.; PackageReference: AXIAL-0.5; Publisher: Altium Limited; Value: 1k

## Sheet smartGarden_Driver_Rev01.SchDoc
size A
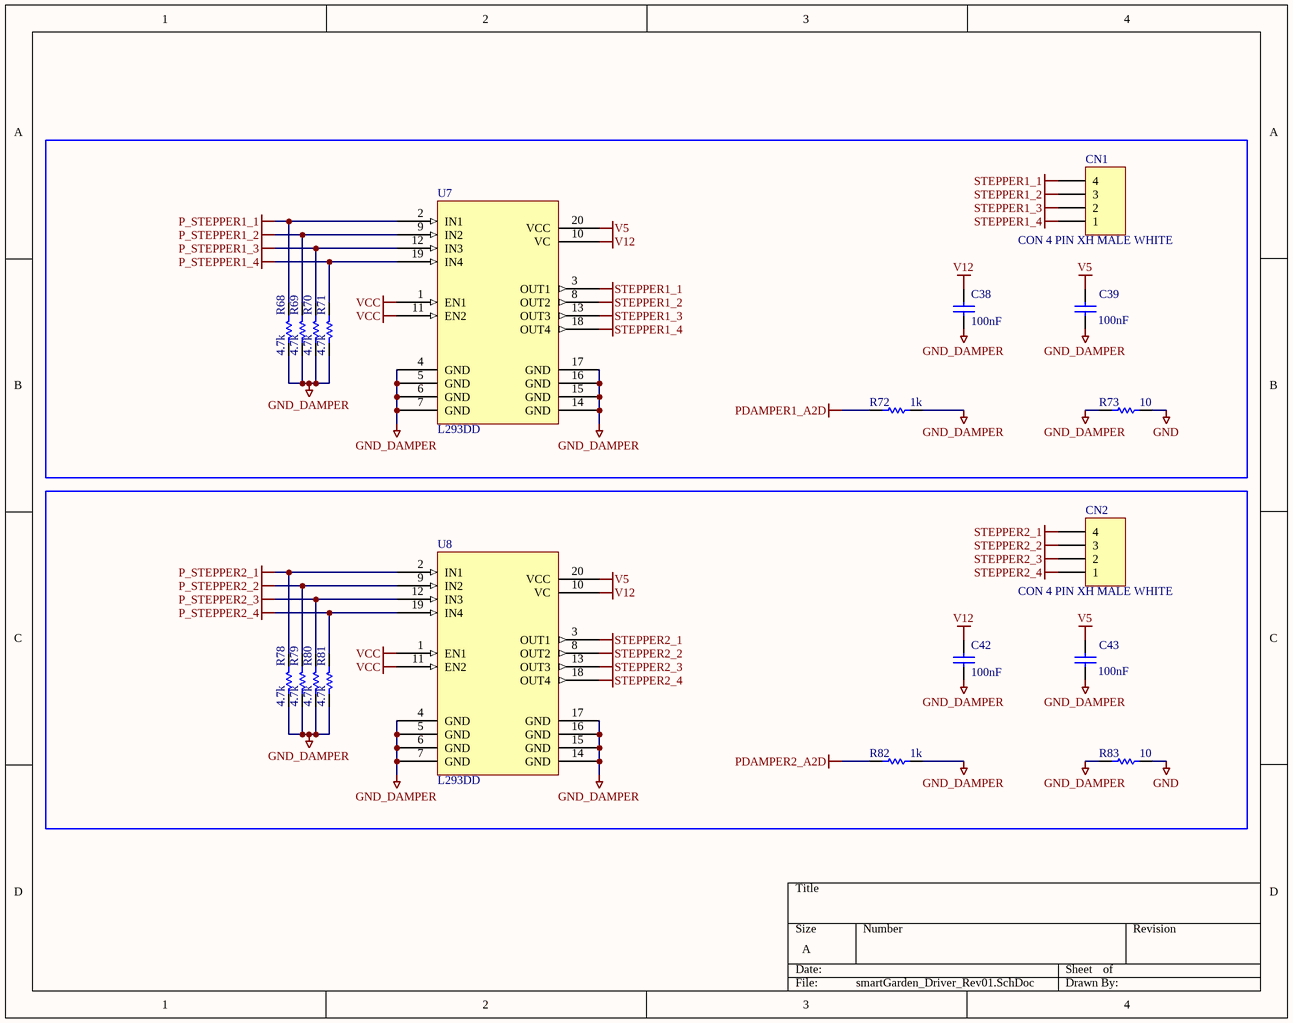
[diagram p6: smartGarden_Driver_Rev01.SchDoc]

### Parts
C38  100nF  [0805_SMD]
C39  100nF  [0805_SMD]
C42  100nF  [0805_SMD]
C43  100nF  [0805_SMD]
CN1  CON 4 PIN XH MALE WHITE  [CON4_XH]
CN2  CON 4 PIN XH MALE WHITE  [CON4_XH]
R68  4.7k  [1206_smd]
R69  4.7k  [0805_smd]
R70  4.7k  [0805_smd]
R71  4.7k  [1206_smd]
R72  1k  [1206_smd]
R73  10  [1206_smd]
R78  4.7k  [1206_smd]
R79  4.7k  [0805_smd]
R80  4.7k  [0805_smd]
R81  4.7k  [1206_smd]
R82  1k  [1206_smd]
R83  10  [1206_smd]
U7  L293DD  [SOP20]
U8  L293DD  [SOP20]

### Nets
GND: R73.1 R83.1
GND_DAMPER: C38.1 C39.1 C42.1 C43.1 R68.1 R69.1 R70.1 R71.1 R72.1 R73.2 R78.1 R79.1 R80.1 R81.1 R82.1 R83.2 U7.4(GND) U7.5(GND) U7.6(GND) U7.7(GND) U7.14(GND) U7.15(GND) U7.16(GND) U7.17(GND) U8.4(GND) U8.5(GND) U8.6(GND) U8.7(GND) U8.14(GND) U8.15(GND) U8.16(GND) U8.17(GND)
P_STEPPER1_1: R68.2 U7.2(IN1)
P_STEPPER1_2: R69.2 U7.9(IN2)
P_STEPPER1_3: R70.2 U7.12(IN3)
P_STEPPER1_4: R71.2 U7.19(IN4)
P_STEPPER2_1: R78.2 U8.2(IN1)
P_STEPPER2_2: R79.2 U8.9(IN2)
P_STEPPER2_3: R80.2 U8.12(IN3)
P_STEPPER2_4: R81.2 U8.19(IN4)
PDAMPER1_A2D: R72.2
PDAMPER2_A2D: R82.2
STEPPER1_1: CN1.4 U7.3(OUT1)
STEPPER1_2: CN1.3 U7.8(OUT2)
STEPPER1_3: CN1.2 U7.13(OUT3)
STEPPER1_4: CN1.1 U7.18(OUT4)
STEPPER2_1: CN2.4 U8.3(OUT1)
STEPPER2_2: CN2.3 U8.8(OUT2)
STEPPER2_3: CN2.2 U8.13(OUT3)
STEPPER2_4: CN2.1 U8.18(OUT4)
V5: C39.2 C43.2 U7.20(VCC) U8.20(VCC)
V12: C38.2 C42.2 U7.10(VC) U8.10(VC)
VCC: U7.1(EN1) U7.11(EN2) U8.1(EN1) U8.11(EN2)

### Library data of the parts
C38 C39 C42 C43 = Cap Semi: Capacitor (Semiconductor SIM Model); Value: ??; Published: 8-Jun-2000; LatestRevisionDate: 17-Jul-2002; LatestRevisionNote: Re-released for DXP Platform.; PackageReference: C1206; Publisher: Altium Limited
CN1 CN2 = Header 4: Header, 4-Pin; LatestRevisionDate: 17-Jul-2002; LatestRevisionNote: Re-released for DXP Platform.; Publisher: Altium Limited
R68-R72 R78-R82 = Res1: Resistor; Published: 8-Jun-2000; LatestRevisionDate: 17-Jul-2002; LatestRevisionNote: Re-released for DXP Platform.; PackageReference: AXIAL-0.3; Publisher: Altium Limited
  R72 R82: Value: 1k
R73 R83 = Res1: Resistor; Value: 1k; Published: 8-Jun-2000; LatestRevisionDate: 17-Jul-2002; LatestRevisionNote: Re-released for DXP Platform.; PackageReference: AXIAL-0.3; Publisher: Altium Limited

## Sheet smartGarden_COM2_Rev01.SchDoc
size A
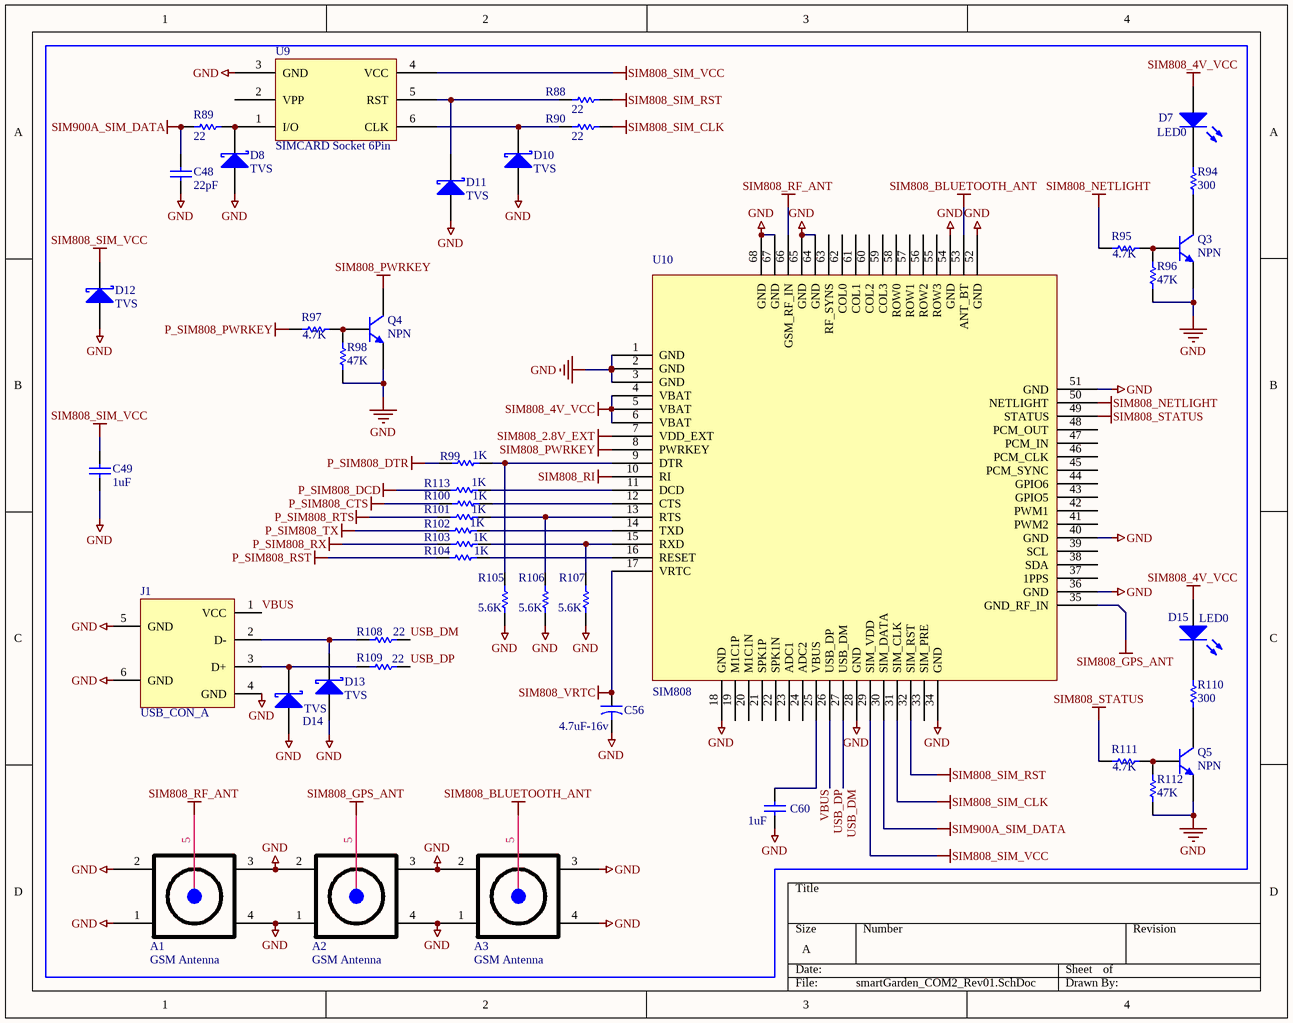
[diagram p7: smartGarden_COM2_Rev01.SchDoc]

### Parts
A1  GSM Antenna  [SMA Right Female]
A2  GSM Antenna  [SMA Right Female]
A3  GSM Antenna  [SMA Right Female]
C48  22pF  [0805_smd]
C49  1uF  [0805_smd]
C56  value 4.7uF-16v  [CAPR5-4X5]  (hidden comment: Cap2)
C60  1uF  [0805_smd]
D7  LED0  [0805_LED]
D8  TVS  [7227_SMD]
D10  TVS  [7227_SMD]
D11  TVS  [7227_SMD]
D12  TVS  [7227_SMD]
D13  TVS  [7227_SMD]
D14  TVS  [7227_SMD]
D15  LED0  [0805_LED]
J1  USB_CON_A  [USB_CON_A]
Q3  NPN  [TO-226-AA]
Q4  NPN  [TO-226-AA]
Q5  NPN  [TO-226-AA]
R88  22  [0805_SMD]
R89  22  [1206_SMD]
R90  22  [0805_SMD]
R94  300  [0805_SMD]
R95  4.7K  [0805_SMD]
R96  47K  [0805_SMD]
R97  4.7K  [0805_SMD]
R98  47K  [0805_SMD]
R99  1K  [1206_SMD]
R100  1K  [1206_SMD]
R101  1K  [1206_SMD]
R102  1K  [1206_SMD]
R103  1K  [1206_SMD]
R104  1K  [1206_SMD]
R105  5.6K  [1206_SMD]
R106  5.6K  [1206_SMD]
R107  5.6K  [1206_SMD]
R108  22  [1206_SMD]
R109  22  [1206_SMD]
R110  300  [0805_SMD]
R111  4.7K  [0805_SMD]
R112  47K  [0805_SMD]
R113  1K  [1206_SMD]
U9  SIMCARD Socket 6Pin  [6PIN _SIMCARD]
U10  SIM808

### Nets
GND: A1.1 A1.2 A1.3 A1.4 A2.1 A2.2 A2.3 A2.4 A3.1 A3.2 A3.3 A3.4 C48.1 C49.1 C56.2 C60.1 D8.A D10.A D11.A D12.A D13.A D14.A J1.4(GND) J1.5(GND) J1.6(GND) Q3.3(E) Q4.3(E) Q5.3(E) R96.1 R98.1 R105.2 R106.2 R107.2 R112.1 U9.3(GND) U10.1(GND) U10.2(GND) U10.3(GND) U10.18(GND) U10.28(GND) U10.34(GND) U10.36(GND) U10.40(GND) U10.51(GND) U10.52(GND) U10.54(GND) U10.64(GND) U10.65(GND) U10.67(GND) U10.68(GND)
P_SIM808_CTS: R100.2
P_SIM808_DCD: R113.2
P_SIM808_DTR: R99.2
P_SIM808_PWRKEY: R97.1
P_SIM808_RST: R104.2
P_SIM808_RTS: R101.2
P_SIM808_RX: R103.2
P_SIM808_TX: R102.2
SIM808_2.8V_EXT: U10.7(VDD_EXT)
SIM808_4V_VCC: D7.1(A) D15.1(A) U10.4(VBAT) U10.5(VBAT) U10.6(VBAT)
SIM808_BLUETOOTH_ANT: A3.5 U10.53(ANT_BT)
SIM808_GPS_ANT: A2.5 U10.35(GND_RF_IN)
SIM808_NETLIGHT: R95.1 U10.50(NETLIGHT)
SIM808_PWRKEY: Q4.1(C) U10.8(PWRKEY)
SIM808_RF_ANT: A1.5 U10.66(GSM_RF_IN)
SIM808_RI: U10.10(RI)
SIM808_SIM_CLK: R90.2 U10.31(SIM_CLK)
SIM808_SIM_RST: R88.2 U10.32(SIM_RST)
SIM808_SIM_VCC: C49.2 D12.K U9.4(VCC) U10.29(SIM_VDD)
SIM808_STATUS: R111.1 U10.49(STATUS)
SIM808_VRTC: C56.1 U10.17(VRTC)
SIM900A_SIM_DATA: C48.2 R89.2 U10.30(SIM_DATA)
USB_DM: R108.2 U10.27(USB_DM)
USB_DP: R109.2 U10.26(USB_DP)
VBUS: C60.2 J1.1(VCC) U10.25(VBUS)
NetD7_2: D7.2(K) R94.2
NetD8_K: D8.K R89.1 U9.1(I/O)
NetD10_K: D10.K R90.1 U9.6(CLK)
NetD11_K: D11.K R88.1 U9.5(RST)
NetD13_K: D13.K J1.2(D-) R108.1
NetD14_K: D14.K J1.3(D+) R109.1
NetD15_2: D15.2(K) R110.2
NetQ3_1: Q3.1(C) R94.1
NetQ3_2: Q3.2(B) R95.2 R96.2
NetQ4_2: Q4.2(B) R97.2 R98.2
NetQ5_1: Q5.1(C) R110.1
NetQ5_2: Q5.2(B) R111.2 R112.2
NetR99_1: R99.1 R105.1 U10.9(DTR)
NetR100_1: R100.1 U10.12(CTS)
NetR101_1: R101.1 R106.1 U10.13(RTS)
NetR102_1: R102.1 U10.14(TXD)
NetR103_1: R103.1 R107.1 U10.15(RXD)
NetR104_1: R104.1 U10.16(RESET)
NetR113_1: R113.1 U10.11(DCD)

Not connected (* = marked no-connect by the designer): U9 2(VPP); U10 19(M1C1P) 20(M1C1N) 21(SPK1P) 22(SPK1N) 23(ADC1) 24(ADC2) 33(SIM_PRE) 37(1PPS) 38(SDA) 39(SCL) 41(PWM2) 42(PWM1) 43(GPIO5) 44(GPIO6) 45(PCM_SYNC) 46(PCM_CLK) 47(PCM_IN) 48(PCM_OUT) 55(ROW3) 56(ROW2) 57(ROW1) 58(ROW0) 59(COL3) 60(COL2) 61(COL1) 62(COL0) 63(RF_SYNS)

### Library data of the parts
A1-A3 = SMA KWE-F
C48 C49 C60 = Cap: Capacitor; Value: 100u; Published: 8-Jun-2000; LatestRevisionDate: 17-Jul-2002; LatestRevisionNote: Re-released for DXP Platform.; PackageReference: RAD-0.3; Publisher: Altium Limited
C56 = Cap2: Capacitor; Published: 23-Sep-2002; PackageReference: CAPR5-4X5; Publisher: Altium Limited; PackageDescription: Capacitor; 2 Leads
D7 D15 = LED0: Typical INFRARED GaAs LED; Published: 8-Jun-2000; LatestRevisionDate: 08-Jul-2005; LatestRevisionNote: Mech Layer 1 removed.; PackageReference: LED-0; Publisher: Altium Limited; PackageDescription: LED; 2 Leads
D8 D10-D14 = D Schottky: Schottky Diode; Published: 8-Jun-2000; LatestRevisionDate: 17-Jul-2002; LatestRevisionNote: Re-released for DXP Platform.; PackageReference: SMB; Publisher: Altium Limited; Code_JEDEC: DO-214-AA
Q3-Q5 = NPN: NPN Bipolar Transistor; Published: 8-Jun-2000; LatestRevisionDate: 17-Jul-2002; LatestRevisionNote: Re-released for DXP Platform.; PackageReference: TO-226-AA; Publisher: Altium Limited; PackageDescription: TO, Flat Index; 3 In-Line, Axial Leads; Body Dia. 4.8mm; Leads 0.55 x 0.51 mm (max); Code_JEDEC: TO-226-AA
R88-R90 R108 R109 = Res1: Resistor; Published: 8-Jun-2000; LatestRevisionDate: 17-Jul-2002; LatestRevisionNote: Re-released for DXP Platform.; PackageReference: AXIAL-0.3; Publisher: Altium Limited; Value: 22
R94-R107 R110-R113 = Res1: Resistor; Value: 22; Published: 8-Jun-2000; LatestRevisionDate: 17-Jul-2002; LatestRevisionNote: Re-released for DXP Platform.; PackageReference: AXIAL-0.3; Publisher: Altium Limited
U9 = SIM_SOCKET_6PIN
U10 = SIM 808 GSM/GPRS/GPS

## Nets that join several sheets
GND: smartGarden_Pow_Rev01 (30 pins), smartGarden_Sen_Rev01 (38 pins), smartGarden_ACT_Rev01 (12 pins), smartGarden_COM_Rev01 (25 pins), smartGarden_Per_Rev01 (32 pins), smartGarden_Driver_Rev01 (R73.1 R83.1), smartGarden_COM2_Rev01 (50 pins)
GND_AN: smartGarden_Pow_Rev01 (C6.1 C7.2 L2.2), smartGarden_COM_Rev01 (U13.2)
NULL: smartGarden_Pow_Rev01 (T4.1 T5.1 T6.1), smartGarden_ACT_Rev01 (T1.1 T2.1 T3.1)
PHASE: smartGarden_Pow_Rev01 (T5.3 T6.3), smartGarden_ACT_Rev01 (RLY1.1 RLY2.1 RLY3.1)
SEN_I2C_SCL: smartGarden_Sen_Rev01 (R55.1 R57.1), smartGarden_Per_Rev01 (R63.1)
SEN_I2C_SDA: smartGarden_Sen_Rev01 (R54.1 R56.1), smartGarden_Per_Rev01 (R62.1)
SIM808_4V_VCC: smartGarden_Pow_Rev01 (11 pins), smartGarden_COM2_Rev01 (5 pins)
V3.3: smartGarden_Pow_Rev01 (6 pins), smartGarden_Sen_Rev01 (R39.1 R40.1 R41.1 R42.1), smartGarden_COM_Rev01 (16 pins), smartGarden_Per_Rev01 (9 pins)
V5: smartGarden_Pow_Rev01 (8 pins), smartGarden_Sen_Rev01 (8 pins), smartGarden_Per_Rev01 (8 pins), smartGarden_Driver_Rev01 (C39.2 C43.2 U7.20 U8.20)
V12: smartGarden_Pow_Rev01 (C1.2 P1.1 R1.2 R16.2), smartGarden_ACT_Rev01 (16 pins), smartGarden_Driver_Rev01 (C38.2 C42.2 U7.10 U8.10)